# Altium schematic sheet TCA_MODULE.SchDoc: My title
size A3; Organization: University of California; Address1: 475 Portola Plaza; Address2: Los Angeles, CA 90095; DocumentNumber: 25; Revision: R01; SheetNumber: 25; SheetTotal: 35
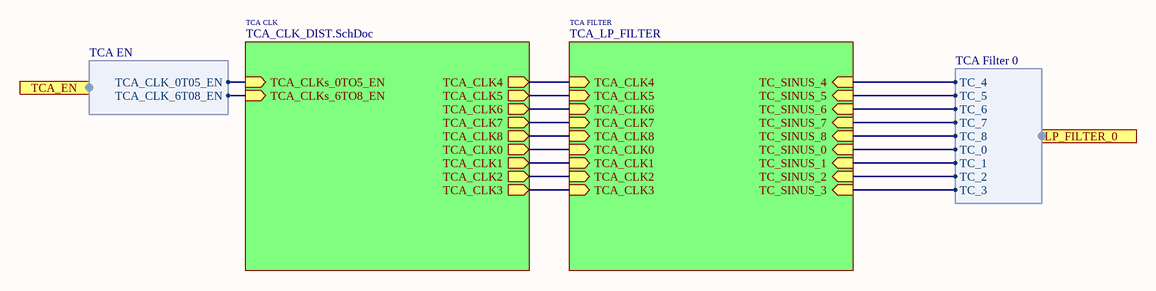
[diagram p0: TCA_MODULE.SchDoc]

## Sub-sheets
TCA CLK = TCA_CLK_DIST.SchDoc: TCA_CLK4 (out), TCA_CLK5 (out), TCA_CLK6 (out), TCA_CLK7 (out), TCA_CLK8 (out), TCA_CLK0 (out), TCA_CLK1 (out), TCA_CLK2 (out), TCA_CLKs_0TO5_EN (in), TCA_CLKs_6TO8_EN (in), TCA_CLK3 (out)
TCA FILTER = TCA_LP_FILTER: TCA_CLK4 (in), TCA_CLK5 (in), TCA_CLK6 (in), TCA_CLK0 (in), TCA_CLK1 (in), TCA_CLK2 (in), TCA_CLK3 (in), TCA_CLK7 (in), TCA_CLK8 (in), TC_SINUS_4 (in), TC_SINUS_5 (in), TC_SINUS_6 (in), TC_SINUS_0 (in), TC_SINUS_1 (in), TC_SINUS_2 (in), TC_SINUS_3 (in), TC_SINUS_7 (in), TC_SINUS_8 (in)

## Ports
LP_FILTER_0 (harness TCA Filter 0), TCA_EN (harness TCA EN)

## Harnesses
TCA Filter 0: TC_4, TC_5, TC_6, TC_7, TC_8, TC_0, TC_1, TC_2, TC_3
TCA EN: TCA_CLK_0T05_EN, TCA_CLK_6T08_EN

## Nets
(unnamed): sheet TCA CLK/TCA_CLK4, sheet TCA FILTER/TCA_CLK4
(unnamed): sheet TCA CLK/TCA_CLK5, sheet TCA FILTER/TCA_CLK5
(unnamed): sheet TCA CLK/TCA_CLK6, sheet TCA FILTER/TCA_CLK6
(unnamed): sheet TCA CLK/TCA_CLK7, sheet TCA FILTER/TCA_CLK7
(unnamed): sheet TCA CLK/TCA_CLK8, sheet TCA FILTER/TCA_CLK8
(unnamed): sheet TCA CLK/TCA_CLK0, sheet TCA FILTER/TCA_CLK0
(unnamed): sheet TCA CLK/TCA_CLK1, sheet TCA FILTER/TCA_CLK1
(unnamed): sheet TCA CLK/TCA_CLK2, sheet TCA FILTER/TCA_CLK2
(unnamed): sheet TCA CLK/TCA_CLKs_0TO5_EN, port TCA_EN.TCA_CLK_0T05_EN
(unnamed): sheet TCA CLK/TCA_CLKs_6TO8_EN, port TCA_EN.TCA_CLK_6T08_EN
(unnamed): sheet TCA CLK/TCA_CLK3, sheet TCA FILTER/TCA_CLK3
(unnamed): sheet TCA FILTER/TC_SINUS_4, port LP_FILTER_0.TC_4
(unnamed): sheet TCA FILTER/TC_SINUS_5, port LP_FILTER_0.TC_5
(unnamed): sheet TCA FILTER/TC_SINUS_6, port LP_FILTER_0.TC_6
(unnamed): sheet TCA FILTER/TC_SINUS_0, port LP_FILTER_0.TC_0
(unnamed): sheet TCA FILTER/TC_SINUS_1, port LP_FILTER_0.TC_1
(unnamed): sheet TCA FILTER/TC_SINUS_2, port LP_FILTER_0.TC_2
(unnamed): sheet TCA FILTER/TC_SINUS_3, port LP_FILTER_0.TC_3
(unnamed): sheet TCA FILTER/TC_SINUS_7, port LP_FILTER_0.TC_7
(unnamed): sheet TCA FILTER/TC_SINUS_8, port LP_FILTER_0.TC_8

## Notes on the sheet
- 475 Portola Plaza
- GAPS TOF
- igarcia91@g.ucla.edu
- Los Angeles, CA
- 310-825-0344
- Size:
- Date:
- Letter
- Revision:
- Time:
- Sheet
- of
- andrew.peck@cern.ch
- spq@ucla.edu
- File: